# EAGLE design rpi_breakout (EAGLE 6.1)
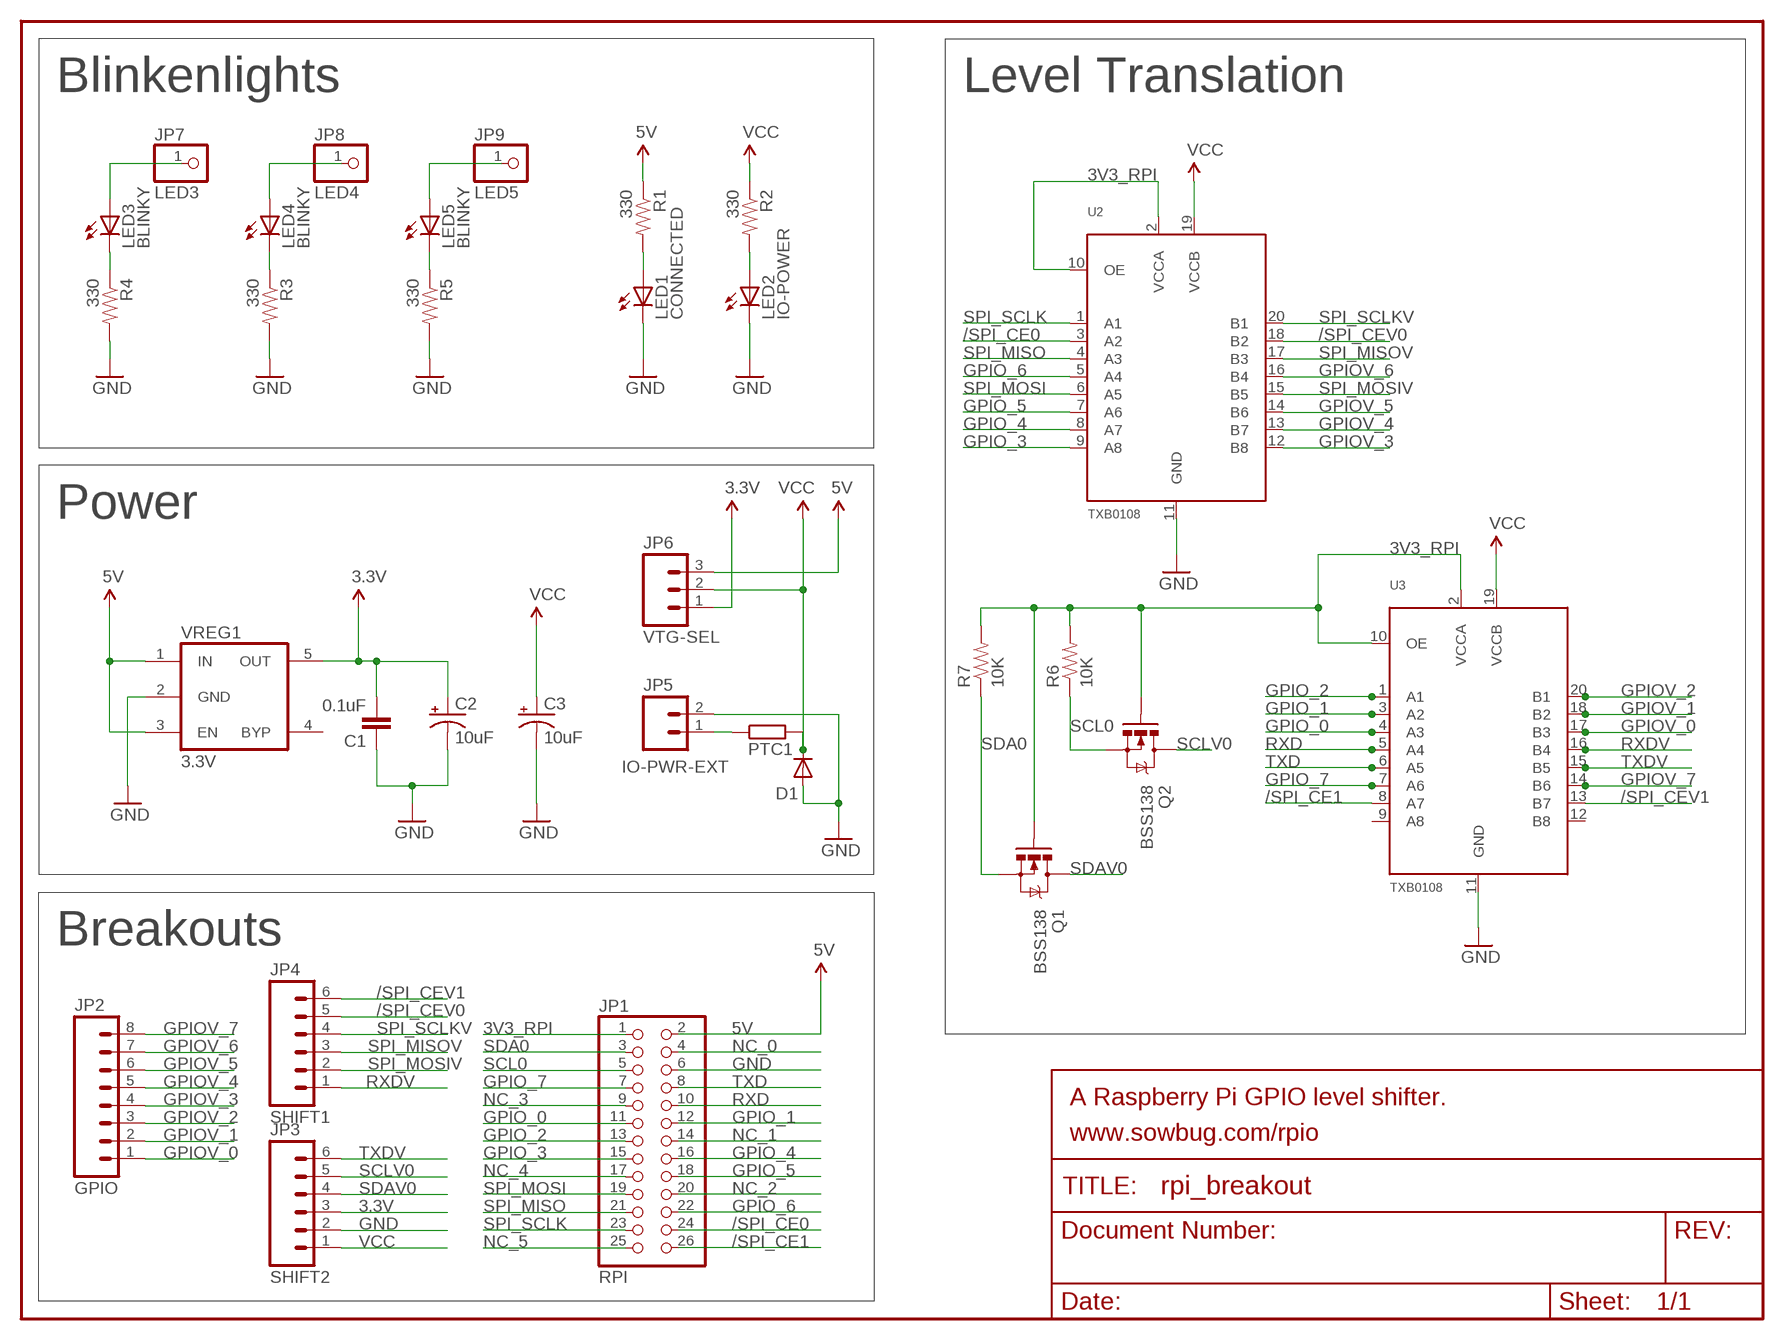
[diagram p0: schematic, sheet 1]

## Parts
C1  0.1uF  SPARKFUN_CAP0805  [SPARKFUN_0805]
C2  10uF  SPARKFUN_CAP_POL1206  [SPARKFUN_EIA3216]
C3  10uF  SPARKFUN_CAP_POL1206  [SPARKFUN_EIA3216]
D1  SPARKFUN-DISCRETESEMI_DIODESOD  [SPARKFUN-DISCRETESEMI_SOD-323]
JP1  RPI  PINHEAD_PINHD-2X13  [PINHEAD_2X13]
JP2  GPIO  SPARKFUN_M08LOCK  [SPARKFUN_1X08_LOCK]
JP3  SHIFT2  SPARKFUN_M06LOCK  [SPARKFUN_1X06_LOCK]
JP4  SHIFT1  SPARKFUN_M06LOCK  [SPARKFUN_1X06_LOCK]
JP5  IO-PWR-EXT  SPARKFUN_M02LOCK  [SPARKFUN_1X02_LOCK]
JP6  VTG-SEL  SPARKFUN_M03LOCK  [SPARKFUN_1X03_LOCK]
JP7  LED3  ADAFRUIT_PINHD-1X1  [ADAFRUIT_1X01]
JP8  LED4  ADAFRUIT_PINHD-1X1  [ADAFRUIT_1X01]
JP9  LED5  ADAFRUIT_PINHD-1X1  [ADAFRUIT_1X01]
LED1  CONNECTED  PROGRAMMER_SPARKFUN_LED  [PROGRAMMER_CHIP-LED0805]
LED2  IO-POWER  PROGRAMMER_SPARKFUN_LED  [PROGRAMMER_CHIP-LED0805]
LED3  BLINKY  PROGRAMMER_SPARKFUN_LED  [PROGRAMMER_CHIP-LED0805]
LED4  BLINKY  PROGRAMMER_SPARKFUN_LED  [PROGRAMMER_CHIP-LED0805]
LED5  BLINKY  PROGRAMMER_SPARKFUN_LED  [PROGRAMMER_CHIP-LED0805]
PTC1  RCL_R-EU_R1206  [RCL_R1206]
Q1  BSS138  SPARKFUN_MOSFET-NCHANNELSMD  [SPARKFUN_SOT23-3]
Q2  BSS138  SPARKFUN_MOSFET-NCHANNELSMD  [SPARKFUN_SOT23-3]
R1  330  SPARKFUN_RESISTOR0805-RES  [SPARKFUN_0805]
R2  330  SPARKFUN_RESISTOR0805-RES  [SPARKFUN_0805]
R3  330  SPARKFUN_RESISTOR0805-RES  [SPARKFUN_0805]
R4  330  SPARKFUN_RESISTOR0805-RES  [SPARKFUN_0805]
R5  330  SPARKFUN_RESISTOR0805-RES  [SPARKFUN_0805]
R6  10K  SPARKFUN_RESISTOR0805-RES  [SPARKFUN_0805]
R7  10K  SPARKFUN_RESISTOR0805-RES  [SPARKFUN_0805]
U2  TXB0108  RPI_BREAKOUT_TXB0108PWR  [RPI_BREAKOUT_TSSOP20]
U3  TXB0108  RPI_BREAKOUT_TXB0108PWR  [RPI_BREAKOUT_TSSOP20]
VREG1  3.3V  DP_DEVICES_IC_VREG_5PINS-SOT-23-5  [DP_DEVICES_SOT-23-5]

## Nets
3.3V [power/gnd]: C1.2 C2.A(+) JP3.3 JP6.1 VREG1.5(OUT)
3V3_RPI: JP1.1 Q1.1(G) Q2.1(G) R6.2 R7.2 U2.2(VCCA) U2.10(OE) U3.2(VCCA) U3.10(OE)
5V [power/gnd]: JP1.2 JP6.3 R1.1 VREG1.1(IN) VREG1.3(EN)
/SPI_CE0: JP1.24 U2.3(A2)
/SPI_CE1: JP1.26 U3.8(A7)
/SPI_CEV0: JP4.5 U2.18(B2)
/SPI_CEV1: JP4.6 U3.13(B7)
GND [power/gnd]: C1.1 C2.C(-) C3.C(-) D1.2(A) JP1.6 JP3.2 JP5.2 LED1.C LED2.C R3.2 R4.2 R5.2 U2.11(GND) U3.11(GND) VREG1.2(GND)
GPIO_0: JP1.11 U3.4(A3)
GPIO_1: JP1.12 U3.3(A2)
GPIO_2: JP1.13 U3.1(A1)
GPIO_3: JP1.15 U2.9(A8)
GPIO_4: JP1.16 U2.8(A7)
GPIO_5: JP1.18 U2.7(A6)
GPIO_6: JP1.22 U2.5(A4)
GPIO_7: JP1.7 U3.7(A6)
GPIOV_0: JP2.1 U3.17(B3)
GPIOV_1: JP2.2 U3.18(B2)
GPIOV_2: JP2.3 U3.20(B1)
GPIOV_3: JP2.4 U2.12(B8)
GPIOV_4: JP2.5 U2.13(B7)
GPIOV_5: JP2.6 U2.14(B6)
GPIOV_6: JP2.7 U2.16(B4)
GPIOV_7: JP2.8 U3.14(B6)
LED3_JP: JP7.1 LED3.A
LED4_JP: JP8.1 LED4.A
LED5_JP1: JP9.1 LED5.A
N$1: LED1.A R1.2
N$2: LED2.A R2.2
N$3: LED3.C R4.1
N$4: LED4.C R3.1
N$5: LED5.C R5.1
NC_0: JP1.4
NC_1: JP1.14
NC_2: JP1.20
NC_3: JP1.9
NC_4: JP1.17
NC_5: JP1.25
RXD: JP1.10 U3.5(A4)
RXDV: JP4.1 U3.16(B4)
SCL0: JP1.5 Q2.2(S) R6.1
SCLV0: JP3.5 Q2.3(D)
SDA0: JP1.3 Q1.2(S) R7.1
SDAV0: JP3.4 Q1.3(D)
SPI_MISO: JP1.21 U2.4(A3)
SPI_MISOV: JP4.3 U2.17(B3)
SPI_MOSI: JP1.19 U2.6(A5)
SPI_MOSIV: JP4.2 U2.15(B5)
SPI_SCLK: JP1.23 U2.1(A1)
SPI_SCLKV: JP4.4 U2.20(B1)
TXD: JP1.8 U3.6(A5)
TXDV: JP3.6 U3.15(B5)
VCC [power/gnd]: C3.A(+) D1.1(C) JP3.1 JP6.2 PTC1.2 R2.1 U2.19(VCCB) U3.19(VCCB)
VCC_FUSE [power/gnd]: JP5.1 PTC1.1
Unconnected: U3.9(A8) U3.12(B8) VREG1.4(BYP)

## Notes on the sheet
- Blinkenlights | Level Translation
- Power
- Breakouts
- A Raspberry Pi GPIO level shifter.
- www.sowbug.com/rpio

## Library data of the parts
C1 = rpi_breakout:SPARKFUN_CAP: Capacitor Standard 0603 ceramic capacitor, and 0.1" leaded capacitor.
C2 C3 = rpi_breakout:SPARKFUN_CAP_POL: Capacitor Polarized These are standard SMD and PTH capacitors. Normally 10uF, 47uF, and 100uF in electrolytic and tantalum varieties. Always verify the external diameter of the through hole cap, it varies with capacity, voltage, and manufacturer. The EIA devices should be standard.
D1 = rpi_breakout:SPARKFUN-DISCRETESEMI_DIODE: Diode These are standard reverse protection diodes and small signal diodes. SMA package can handle up to about 1A. SOD-323 can handle about 200mA. What the SOD-323 package when ordering, there are some mfgs out there that are 5-pin packages.
JP1 = rpi_breakout:PINHEAD_PINHD-2X13: PIN HEADER
JP2 = rpi_breakout:SPARKFUN_M08: Header 8 Standard 8-pin 0.1" header. Use with straight break away headers (SKU : PRT-00116), right angle break away headers (PRT-00553), swiss pins (PRT-00743), machine pins (PRT-00117), and female headers (PRT-00115).
JP3 JP4 = rpi_breakout:SPARKFUN_M06
JP5 = rpi_breakout:SPARKFUN_M02: Header 2 Standard 2-pin 0.1" header. Use with straight break away headers (SKU : PRT-00116), right angle break away headers (PRT-00553), swiss pins (PRT-00743), machine pins (PRT-00117), and female headers (PRT-00115). Molex polarized connector foot print use with SKU : PRT-08233 with associated crimp pins and housings.
JP6 = rpi_breakout:SPARKFUN_M03: Header 3 Standard 3-pin 0.1" header. Use with straight break away headers (SKU : PRT-00116), right angle break away headers (PRT-00553), swiss pins (PRT-00743), machine pins (PRT-00117), and female headers (PRT-00115). Molex polarized connector foot print use with SKU : PRT-08232 with associated crimp pins and housings.
JP7-JP9 = rpi_breakout:ADAFRUIT_PINHD-1X1: Pin header 1x1 for 0.1" spacing With round pins
LED1-LED5 = rpi_breakout:PROGRAMMER_SPARKFUN_LED: LEDs Standard schematic elements and footprints for 5mm, 3mm, 1206, and 0603 sized LEDs. 5mm - Spark Fun Electronics SKU : COM-00529 (and others)
PTC1 = rpi_breakout:RCL_R-EU_: RESISTOR, European symbol
Q1 Q2 = rpi_breakout:SPARKFUN_MOSFET-NCHANNEL
R1-R7 = rpi_breakout:SPARKFUN_RESISTOR: Resistor Basic schematic elements and footprints for 0603, 1206, and PTH resistors.
U2 U3 = rpi_breakout:RPI_BREAKOUT_TXB0108PWR: 8-Bit Bi-Directional Level Shifter 1.2V-3.6V (VCCA) to 1.65V-5.5V (VCCB) bi-directional level shifter with auto direction sensing. Max data rate - VCCA 1.8V: 20Mbps (50ns), VCCA 3.3V: 100Mbps (10ns) Digikey: 296-21527-1-ND
VREG1 = rpi_breakout:DP_DEVICES_IC_VREG_5PINS: 5 pins voltage regulator

## Net classes
0 default: width 0.254 mm, clearance 0.254 mm
1 power/gnd: width 0.406 mm, clearance 0.254 mm
2 skinny: width 0.203 mm, clearance 0.203 mm

## Board
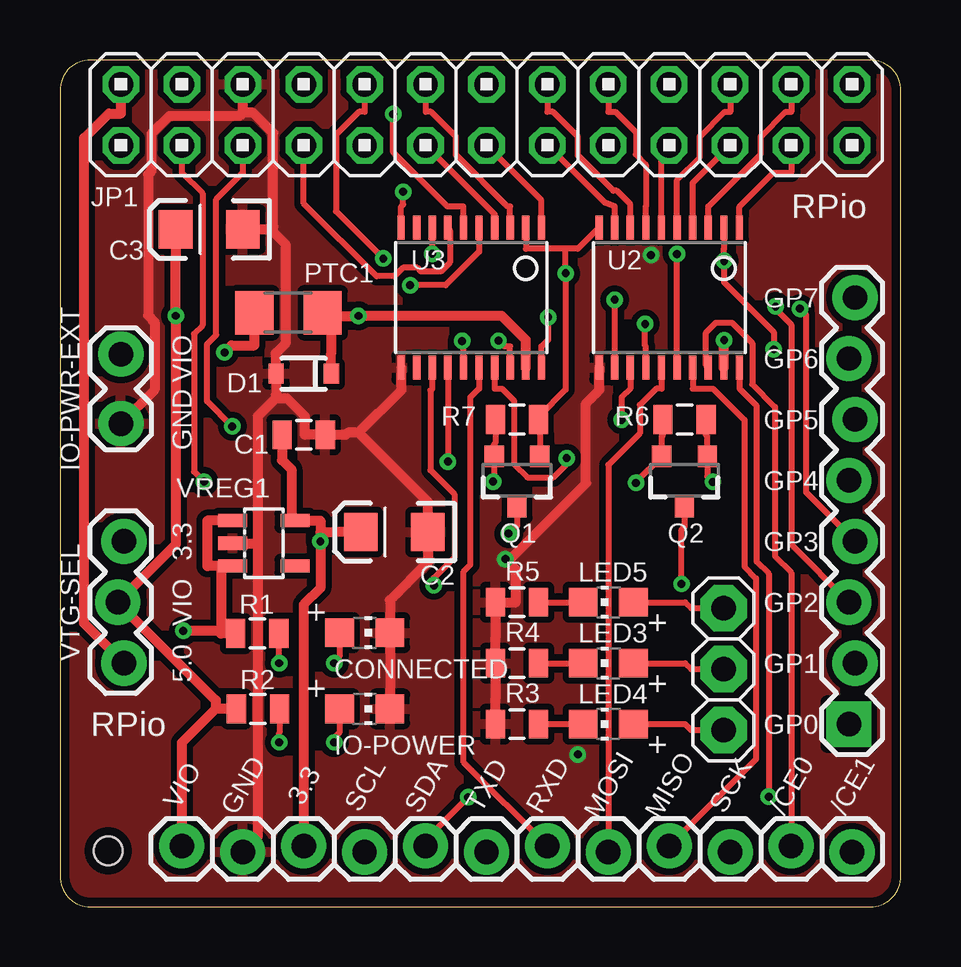
[diagram p1: board, top side]
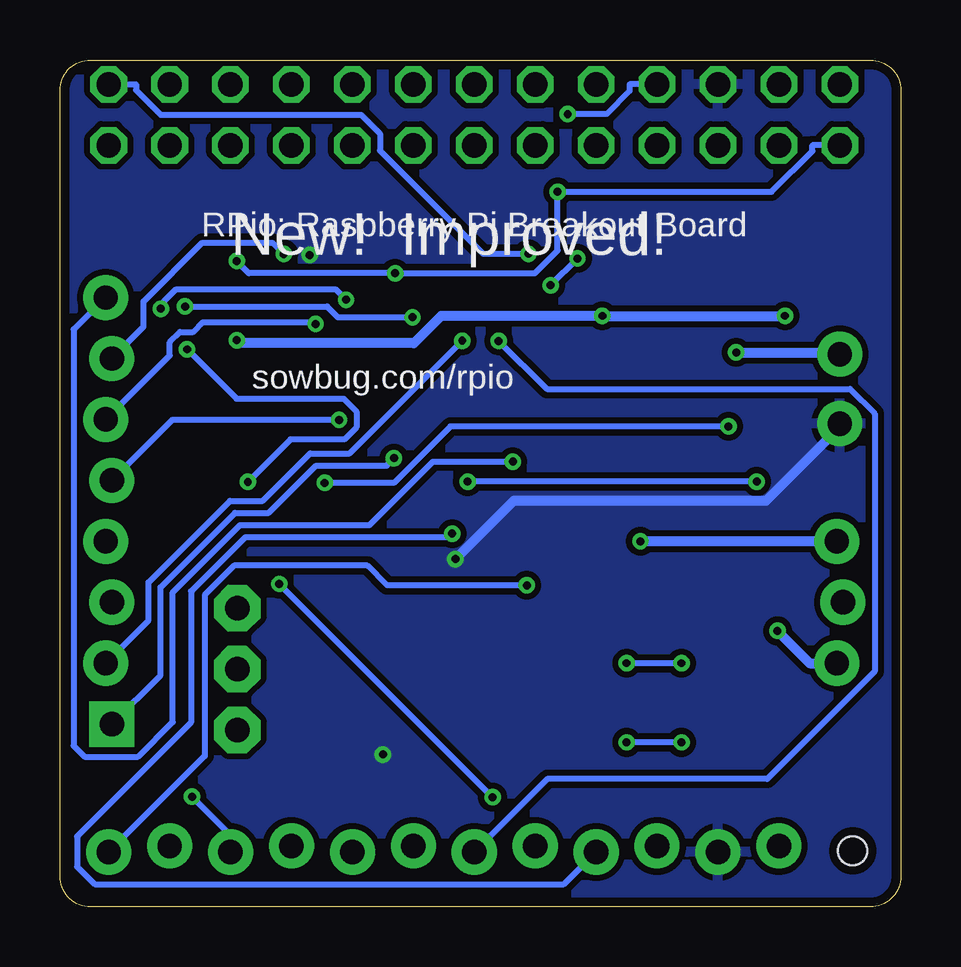
[diagram p2: board, bottom side, seen from below]

Size 35.05 x 35.31 mm. Coordinates in mm from the lower left corner, seen from the top.
Outline: 1.27,0 33.78,0 arc90 35.05,1.27 35.05,34.04 arc90 33.78,35.31 1.27,35.31 arc90 0,34.04 0,1.27 arc90 1.27,0
Copper layers (1*16): Top 0.0356mm / dielectric 1.5011mm / Bottom 0.0356mm
Design rules: minimum track width 6mil, minimum drill 13mil, track to track 6mil, track to pad 6mil, pad to pad 6mil, via to via 6mil, smd to smd 6mil, copper to edge 15mil, drill to drill 6mil, minimum pad ring 7mil, minimum via ring 7mil, stop-mask expansion 4mil, vias tented up to drill 0mil, thermal gap 10mil
Holes 1.2 mm at 2.01,2.34
vRestrict: area 15.2,21.6 to 27.9,22.9; area 3.8,27.9 to 31.8,29.2

### Footprints (pad centres in the part's own frame; a part is rotated, then mirrored left to right if it is on the bottom)
SPARKFUN_0805 = smd 0.8 x 1.2: 1 -0.9,0; 2 0.9,0
SPARKFUN_EIA3216 = smd 1.4 x 1.6: A 1.4,0; C -1.4,0
SPARKFUN-DISCRETESEMI_SOD-323 = smd 0.63 x 0.83: 1 -1.15,0; 2 1.15,0
PINHEAD_2X13 = drill 1.016 octagon: 1 -15.24,-1.27; 2 -15.24,1.27; 3 -12.7,-1.27; 4 -12.7,1.27; 5 -10.16,-1.27; 6 -10.16,1.27; 7 -7.62,-1.27; 8 -7.62,1.27; 9 -5.08,-1.27; 10 -5.08,1.27; 11 -2.54,-1.27; 12 -2.54,1.27; 13 0,-1.27; 14 0,1.27; 15 2.54,-1.27; 16 2.54,1.27; 17 5.08,-1.27; 18 5.08,1.27; 19 7.62,-1.27; 20 7.62,1.27; 21 10.16,-1.27; 22 10.16,1.27; 23 12.7,-1.27; 24 12.7,1.27; 25 15.24,-1.27; 26 15.24,1.27
SPARKFUN_1X08_LOCK = drill 1.016 pad 1.88 square: 1 0,0.127 | drill 1.016 pad 1.88: 2 2.54,-0.127; 3 5.08,0.127; 4 7.62,-0.127; 5 10.16,0.127; 6 12.7,-0.127; 7 15.24,0.127; 8 17.78,-0.127
SPARKFUN_1X06_LOCK = drill 1.016 pad 1.88: 1 0,0; 2 2.54,-0.254; 3 5.08,0; 4 7.62,-0.254; 5 10.16,0; 6 12.7,-0.254
SPARKFUN_1X02_LOCK = drill 1.016 pad 1.88: 1 -0.178,0; 2 2.718,0
SPARKFUN_1X03_LOCK = drill 1.016 pad 1.88: 1 0,0.127; 2 2.54,-0.127; 3 5.08,0.127
ADAFRUIT_1X01 = drill 1.016 pad 1.93 octagon: 1 0,0
PROGRAMMER_CHIP-LED0805 = smd 1.2 x 1.2: A 0,-1.05; C 0,1.05
RCL_R1206 = smd 1.6 x 1.803: 1 -1.422,0; 2 1.422,0
SPARKFUN_SOT23-3 = smd 0.8 x 0.9: 1 -0.95,-1; 2 0.95,-1; 3 0,1.1
RPI_BREAKOUT_TSSOP20 = smd 0.305 x 0.991: 1 -2.925,-2.918; 2 -2.275,-2.918; 3 -1.625,-2.918; 4 -0.975,-2.918; 5 -0.325,-2.918; 6 0.325,-2.918; 7 0.975,-2.918; 8 1.625,-2.918; 9 2.275,-2.918; 10 2.925,-2.918; 11 2.925,2.918; 12 2.275,2.918; 13 1.625,2.918; 14 0.975,2.918; 15 0.325,2.918; 16 -0.325,2.918; 17 -0.975,2.918; 18 -1.625,2.918; 19 -2.275,2.918; 20 -2.925,2.918
DP_DEVICES_SOT-23-5 = smd 0.55 x 1.2: 1 -0.95,-1.3; 2 0,-1.3; 3 0.95,-1.3; 4 0.95,1.3; 5 -0.95,1.3

### Placement (x,y rotation side)
C1  10.16,19.68 180 top
C2  13.94,15.63 180 top
C3  6.22,28.24 180 top
D1  10.16,22.23 180 top
JP1  17.78,33.02 0 top
JP2  33.02,7.62 90 top
JP3  5.08,2.54 0 top
JP4  20.32,2.54 0 top
JP5  2.54,22.86 270 top
JP6  2.54,15.24 270 top
JP7  27.66,9.91 0 top
JP8  27.66,7.37 0 top
JP9  27.66,12.45 0 top
LED1  12.7,11.43 270 top
LED2  12.7,8.26 270 top
LED3  22.86,10.16 90 top
LED4  22.86,7.62 90 top
LED5  22.86,12.7 90 top
PTC1  9.53,24.77 0 top
Q1  19.05,17.78 180 top
Q2  26.04,17.78 180 top
R1  8.22,11.39 0 top
R2  8.26,8.26 0 top
R3  19.05,7.62 180 top
R4  19.05,10.16 180 top
R5  19.05,12.7 180 top
R6  26.04,20.32 0 top
R7  19.05,20.32 0 top
U2  25.4,25.4 180 top
U3  17.14,25.4 180 top
VREG1  8.5,15.16 270 top

### Tracks (layer width: path | path; a pad name or v marks a point on that pad's centre or on a via)
3.3V  (via drill 0.33 pad 0.69)
  Top 0.406: JP3.3 10.16,12.6 10.86,13.29 v10.86,15.24 10.86,15.63 | 10.86,15.63 10.86,16.11 VREG1.5 9.65,16.26 9.65,18.24 9.26,18.63 C1.2 | 10.86,15.63 11.38,15.63 C2.A
  Bottom 0.406: JP6.1 v10.86,15.24
3V3_RPI  (via drill 0.33 pad 0.69)
  Top 0.254: v27.22,17.71 26.98,17.95 Q2.1 26.98,19.2 26.98,19.61 26.93,19.66 R6.2 | v29.75,23.25 29.75,23.97 27.69,26.04 v27.69,26.92 27.69,27.43 27.68,27.44 U2.2 | 21.08,27.43 19.43,27.43 19.42,27.44 U3.2 | U2.10 21.59,27.43 21.08,27.43 | 21.08,27.43 v21.08,26.42 21.08,21.56 20,20.48 | 20,20.48 20,20.37 R7.2 | 20,20.48 Q1.1 | U3.10 14.22,29.19 14.3,29.28 v14.3,29.81
  Bottom 0.254: v29.75,23.25 27.69,21.18 23.22,21.18 22.69,20.65 22.69,19.99 23.19,19.49 25.44,19.49 v27.22,17.71 | JP1.1 3.68,31.75 3.68,31.51 5.39,29.81 v14.3,29.81 14.3,27.36 15.25,26.42 v21.08,26.42 27.18,26.42 v27.69,26.92
5V  (via drill 0.33 pad 0.69)
  Top 0.406: 6.71,11.51 6.71,11.39 R1.1 | 6.71,14.21 6.71,11.51 | 6.71,11.51 v5.14,11.51 | 6.71,14.21 6.14,14.21 6.14,16.11 VREG1.1 | VREG1.3 6.71,14.21 | JP1.2 2.54,33.07 2.04,33.07 1.01,32.05 1.01,11.82 JP6.3
  Bottom 0.406: v5.14,11.51 3.79,10.16 JP6.3
/SPI_CE0
  Top 0.254: JP1.24 30.48,33.15 30.24,33.15 29.21,32.11 29.21,31.38 27.02,29.19 U2.3
/SPI_CE1  (via drill 0.33 pad 0.69)
  Top 0.254: U3.8 v15.52,27.23
  Bottom 0.254: v15.52,27.23 17.41,27.23 21.72,31.53 21.72,32.24 22.5,33.02 30.84,33.02 31.88,34.05 31.88,34.29 JP1.26
/SPI_CEV0
  Top 0.254: U2.18 26.93,22.57 26.93,23.95 27.34,24.35 28.01,24.35 28.86,23.5 28.86,21.79 29.8,20.85 29.8,14.61 30.48,13.93 JP4.5
/SPI_CEV1  (via drill 0.33 pad 0.69)
  Top 0.254: U3.13 15.52,21.61 15.45,21.53 15.45,18.2 16.45,17.2 16.45,14.57 15.59,13.72 v15.59,13.4
  Bottom 0.254: v15.59,13.4 21.41,13.4 22.23,14.22 27.79,14.22 29.02,13 29.02,6.29 JP4.6
GND  (via drill 0.33 pad 0.69)
  Top 0.406: LED2.C LED1.C 13.75,12.78 15.34,14.37 C2.C 15.34,16.89 12.46,19.77 | 7.62,33.1 7.49,32.97 4.56,32.97 3.81,32.22 3.81,30.67 3.67,30.53 3.67,24.66 3.95,24.39 3.95,21.55 JP5.2 | 8.78,28.24 8.89,28.35 8.89,32.26 8.04,33.1 7.62,33.1 | JP1.6 7.62,33.1 | 9.01,21.21 9.45,21.21 10.2,20.46 10.2,19.68 C1.1 11.92,19.68 12,19.77 12.46,19.77 | 9.01,21.21 9.01,21.35 D1.2 9.01,23.1 9.4,23.49 9.4,27.63 8.78,28.24 | 8.26,15.16 8.26,20.45 9.01,21.21 | JP3.2 8.26,2.92 8.26,15.16 | R3.2 18.15,8.68 R4.2 18.15,11.22 R5.2 19.01,12.7 19.01,14.06 v18.57,14.5 18.77,14.5 21.93,17.66 21.93,20.99 22.48,21.53 U2.11 | VREG1.2 8.26,15.16 | C3.C 8.78,28.24 | 12.46,19.77 14.22,21.53 U3.11
  Bottom 0.406: JP5.2 2.54,20 5.62,16.93 16.14,16.93 v18.57,14.5
  other vias: 24.64,27.18 21.59,6.35
  pour Bottom (isolate 0.254): 0,35.56 35.56,35.56 35.56,0 0,0
  pour Top (isolate 0.254): 0,35.56 35.56,35.56 35.56,0 0,0
GPIO_0
  Top 0.254: U3.4 18.12,28.87 JP1.11
GPIO_1
  Top 0.254: JP1.12 15.24,33.15 15.48,33.15 16.51,32.11 16.51,31.35 18.66,29.19 18.77,29.19 U3.3
GPIO_2
  Top 0.254: U3.1 20.07,29.46 JP1.13
GPIO_3
  Top 0.254: U2.9 23.12,29.19 22.72,29.35 JP1.15
GPIO_4
  Top 0.254: JP1.16 20.32,33.15 20.56,33.15 21.59,32.11 21.59,31.34 23.07,29.86 23.21,29.86 23.77,29.29 U2.8
GPIO_5
  Top 0.254: U2.7 24.43,29.19 24.43,30.95 24,31.37 24,32.29 23.15,33.15 22.86,33.15 JP1.18
GPIO_6
  Top 0.254: JP1.22 27.94,33.15 27.7,33.15 26.67,32.11 26.67,31.24 25.73,30.3 U2.5
GPIO_7
  Top 0.254: U3.7 16.26,28.19 16.26,26.86 15.88,26.49 15.05,26.49 14.9,26.64 14.3,26.64 13.94,26.29 13.2,26.29 10.16,29.32 JP1.7
GPIOV_0  (via drill 0.33 pad 0.69)
  Top 0.254: v21.13,18.7 21.13,18.46 20.57,17.9 19.48,17.9 18.93,18.45 18.93,21.1 18.43,21.61 18.12,21.61 U3.17
  Bottom 0.254: JP2.1 30.85,9.66 30.85,13.32 27.75,16.42 26.35,16.42 24.38,18.4 21.43,18.4 v21.13,18.7
GPIOV_1  (via drill 0.33 pad 0.69)
  Top 0.254: U3.18 18.77,23.36 18.52,23.36 v18.28,23.6
  Bottom 0.254: JP2.2 31.36,11.95 31.36,13.53 27.96,16.93 26.59,16.93 24.62,18.91 22.98,18.91 v18.28,23.6
GPIOV_2  (via drill 0.33 pad 0.69)
  Top 0.254: v29.83,25.03 29.83,24.92 30.48,24.28 30.48,15.11 JP2.3 | v20.35,24.59 20.35,23.64 20.07,23.36 U3.20
  Bottom 0.254: v29.83,25.03 23.91,25.03 23.47,24.59 v20.35,24.59
GPIOV_3  (via drill 0.33 pad 0.69)
  Top 0.254: U2.12 v23.12,25.31 | v30.85,24.94 31.1,24.68 31.1,17.29 JP2.4
  Bottom 0.254: v30.85,24.94 30.85,25.1 30.2,25.75 23.56,25.75 v23.12,25.31
GPIOV_4  (via drill 0.33 pad 0.69)
  Top 0.254: U2.13 23.77,21.61 23.42,21.25 v23.42,20.3
  Bottom 0.254: v23.42,20.3 30.37,20.3 JP2.5
GPIOV_5  (via drill 0.33 pad 0.69)
  Top 0.254: U2.14 24.43,23.36 24.39,23.39 v24.39,24.3
  Bottom 0.254: JP2.6 30.48,22.99 30.48,23.55 30.05,23.97 29.5,23.97 29.09,24.37 24.46,24.37 v24.39,24.3
GPIOV_6  (via drill 0.33 pad 0.69)
  Top 0.254: U2.16 v25.73,27.21
  Bottom 0.254: JP2.7 31.57,24.18 31.57,25.24 29.12,27.68 26.19,27.68 v25.73,27.21
GPIOV_7  (via drill 0.33 pad 0.69)
  Top 0.254: U3.14 v16.17,18.56
  Bottom 0.254: JP2.8 34.48,24.07 34.48,6.71 34.02,6.26 31.79,6.26 30.35,7.71 30.35,13.11 27.54,15.91 22.15,15.91 19.5,18.56 v16.17,18.56
LED3_JP
  Top 0.254: JP7.1 26.31,9.91 26.06,10.16 LED3.A
LED4_JP
  Top 0.254: JP8.1 26.31,7.37 26.06,7.62 LED4.A
LED5_JP1
  Top 0.254: JP9.1 26.31,12.45 26.06,12.7 LED5.A
N$1  (via drill 0.33 pad 0.69)
  Top 0.254: R1.2 9.12,10.41 9.14,10.39 v9.14,10.16 | LED1.A 11.65,10.45 11.43,10.23 v11.43,10.16
  Bottom 0.254: v9.14,10.16 v11.43,10.16
N$2  (via drill 0.33 pad 0.69)
  Top 0.254: R2.2 9.15,7.27 9.14,7.26 v9.14,6.86 | LED2.A 11.65,7.27 11.43,7.05 v11.43,6.86
  Bottom 0.254: v9.14,6.86 v11.43,6.86
N$3
  Top 0.254: R4.1 LED3.C
N$4
  Top 0.254: R3.1 LED4.C
N$5
  Top 0.254: R5.1 LED5.C
RXD  (via drill 0.33 pad 0.69)
  Top 0.254: v13.48,27.03 11.51,29 11.51,32.19 12.46,33.15 12.7,33.15 JP1.10 | U3.5 17.47,27.31 16.07,25.92 v14.6,25.92
  Bottom 0.254: v14.6,25.92 v13.48,27.03
RXDV
  Top 0.254: JP4.1 16.83,6.03 16.83,13.98 17.11,14.27 17.11,21.25 17.47,21.61 U3.16
SCL0  (via drill 0.33 pad 0.69)
  Top 0.254: v24.02,17.68 24.02,17.71 Q2.2 25.09,19.61 25.14,19.66 R6.1 | JP1.5 7.62,30.61 6.51,29.5 6.51,23.84 6.13,23.46 6.13,21.08 v7.18,20.03
  Bottom 0.254: v7.18,20.03 18.77,20.03 21.13,17.68 v24.02,17.68
SCLV0  (via drill 0.33 pad 0.69)
  Top 0.254: Q2.3 26.04,15.85 25.91,15.72 v25.91,13.46 | JP3.5 15.24,2.79 v17.02,4.57
  Bottom 0.254: v17.02,4.57 v25.91,13.46
SDA0  (via drill 0.33 pad 0.69)
  Top 0.254: v18.06,17.73 18.06,17.91 18.1,17.95 Q1.2 18.1,19.29 18.15,19.34 R7.1 | v6,17.73 5.59,18.14 5.59,23.89 5.94,24.24 5.94,29.75 5.08,30.61 JP1.3
  Bottom 0.254: v6,17.73 v18.06,17.73
SDAV0  (via drill 0.33 pad 0.69)
  Top 0.254: Q1.3 19.05,15.85 18.99,15.85 v18.7,15.56
  Bottom 0.254: v18.7,15.56 18.86,15.4 27.33,15.4 29.58,13.15 29.58,7.69 34.34,2.94 34.34,1.68 33.6,0.94 14.04,0.94 JP3.4
SPI_MISO
  Top 0.254: U2.4 26.38,30.18 JP1.21
SPI_MISOV
  Top 0.254: JP4.3 29.02,6.16 29.02,13.7 28.53,14.19 28.53,20.3 27.23,21.61 26.38,21.61 U2.17
SPI_MOSI
  Top 0.254: U2.6 25.07,31.43 JP1.19
SPI_MOSIV
  Top 0.254: JP4.2 22.86,18.43 24.17,19.74 24.17,20.92 24.85,21.61 25.07,21.61 U2.15
SPI_SCLK
  Top 0.254: JP1.23 30.48,30.61 29.74,30.61 28.32,29.19 U2.1
SPI_SCLKV  (via drill 0.33 pad 0.69)
  Top 0.254: v29.55,4.59 29.55,13.89 29.04,14.4 29.04,20.89 28.32,21.61 U2.20
  Bottom 0.254: v29.55,4.59 27.94,2.98 JP4.4
TXD  (via drill 0.33 pad 0.69)
  Top 0.254: U3.6 16.82,29.19 16.15,29.19 13.89,31.45 v13.89,33.05
  Bottom 0.254: JP1.8 11.3,34.29 11.3,34 12.26,33.05 v13.89,33.05
TXDV  (via drill 0.33 pad 0.69)
  Top 0.254: U3.15 16.82,23.36 16.76,23.41 v16.76,23.59
  Bottom 0.254: v16.76,23.59 14.76,21.59 2.12,21.59 1.09,20.56 1.09,9.81 5.57,5.33 14.73,5.33 JP3.6
VCC  (via drill 0.33 pad 0.69)
  Top 0.406: 6.5,8.26 6.5,8.62 JP6.2 4.83,15.11 v4.83,24.64 4.83,26.99 C3.A | 6.5,8.26 5.08,6.84 JP3.1 | 6.5,8.26 6.53,8.26 R2.1 | 11.31,24.64 v12.45,24.64 18.42,24.64 19.42,23.64 19.42,23.43 U3.19 | PTC1.2 11.18,24.64 11.31,24.64 | 11.31,24.64 11.31,23.1 D1.1 | U2.19 27.68,23.43 27.69,23.45 v27.69,23.62
  Bottom 0.406: v27.69,23.62 27.57,23.5 20.3,23.5 19.16,24.64 v12.45,24.64 v4.83,24.64
VCC_FUSE  (via drill 0.33 pad 0.69)
  Top 0.406: PTC1.1 8.1,23.41 7.15,23.41 v6.86,23.11
  Bottom 0.406: v6.86,23.11 2.62,23.11 JP5.1

### Text on the board
tPlace: RPio | VIO | GND | 3.3 | VIO | 5.0 | RPio
bPlace: RPio: Raspberry Pi Breakout Board | sowbug.com/rpio
tNames: GP7 | GP6 | GP5 | GP4 | GP3 | GP2 | GP1 | GP0 | VIO | GND | 3.3 | SCL | SDA | TXD | RXD | MOSI | MISO | SCK | /CE0 | /CE1
bNames: New! Improved!